# Altium schematic sheet RPL_MAP.SchDoc: Power Distribution Board Top View
size A; Date: Dec 27, 2017; DrawnBy: Seyed Omid Hasanli; Revision: 4.0; SheetNumber: 14
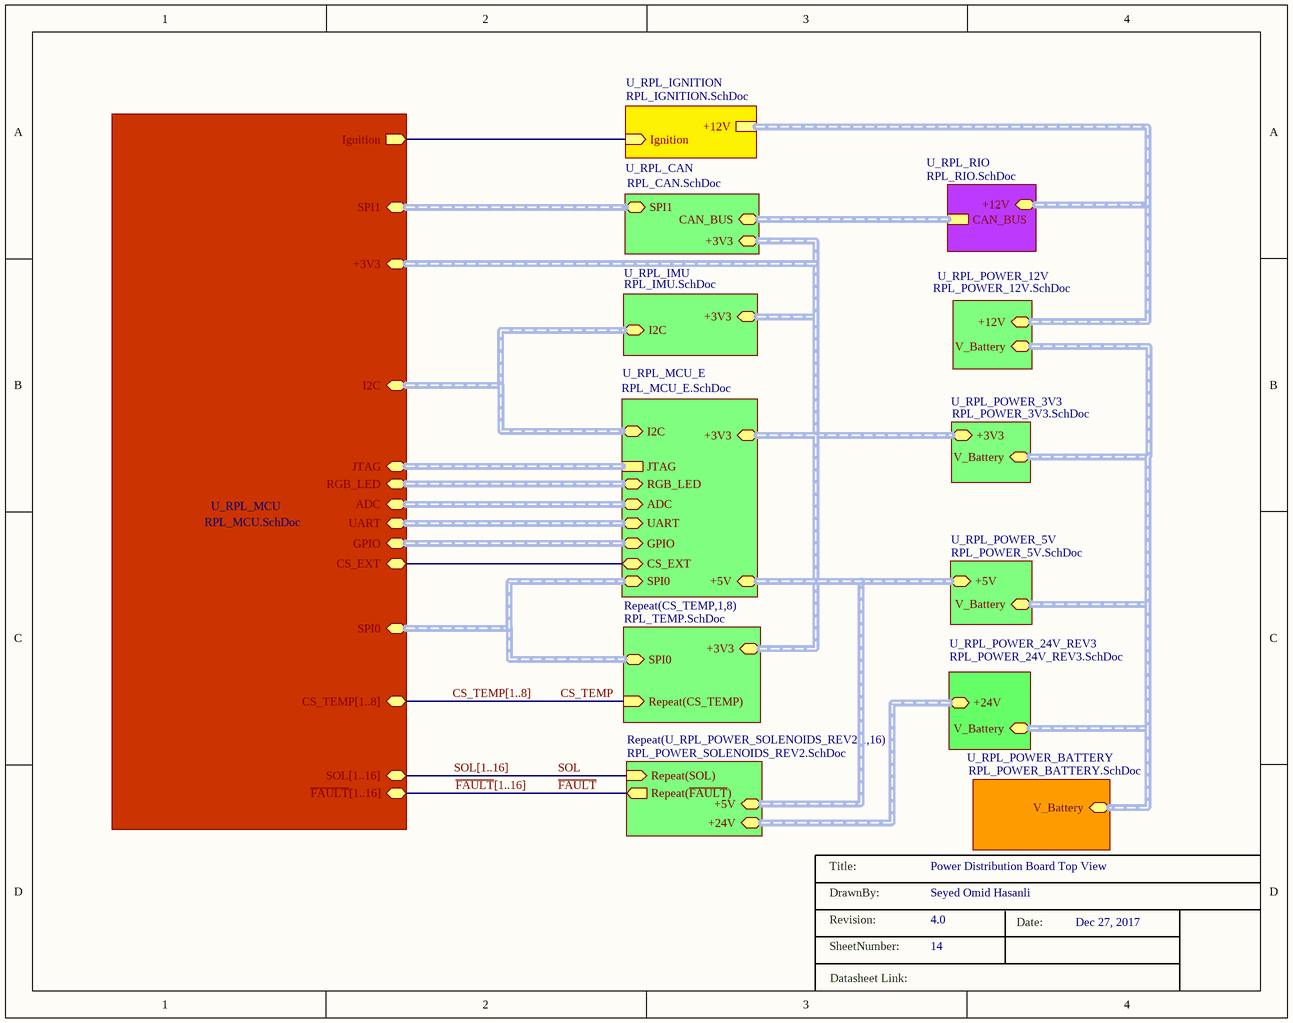
[diagram p0: RPL_MAP.SchDoc]

## Sub-sheets
Repeat(CS_TEMP,1,8) = RPL_TEMP.SchDoc: Repeat(CS_TEMP) (in), +3V3 (harness +3V3), SPI0 (harness SPI0)
Repeat(U_RPL_POWER_SOLENOIDS_REV2,1,16) = RPL_POWER_SOLENOIDS_REV2.SchDoc: Repeat(SOL) (in), Repeat(~{FAULT}) (out), +5V (harness +5V), +24V (harness +24V)
U_RPL_CAN = RPL_CAN.SchDoc: CAN_BUS (harness CAN), SPI1 (harness SPI1), +3V3 (harness +3V3)
U_RPL_IGNITION = RPL_IGNITION.SchDoc: +12V (harness +12V), Ignition (in)
U_RPL_IMU = RPL_IMU.SchDoc: I2C (harness I2C), +3V3 (harness +3V3)
U_RPL_MCU = RPL_MCU.SchDoc: ~{FAULT}[1..16], SOL[1..16], CS_TEMP[1..8], UART (harness UART), JTAG (harness JTAG), ADC (harness ADC), RGB_LED (harness RGB_LED), GPIO (harness GPIO), SPI0 (harness SPI0), SPI1 (harness SPI1), I2C (harness I2C), +3V3 (harness +3V3), CS_EXT (bidir), Ignition (out)
U_RPL_MCU_E = RPL_MCU_E.SchDoc: JTAG (harness JTAG), RGB_LED (harness RGB_LED), ADC (harness ADC), UART (harness UART), CS_EXT, GPIO (harness GPIO), I2C (harness I2C), SPI0 (harness SPI0), +3V3 (harness +3V3), +5V (harness +5V)
U_RPL_POWER_3V3 = RPL_POWER_3V3.SchDoc: +3V3 (harness +3V3), V_Battery (harness V_Battery)
U_RPL_POWER_5V = RPL_POWER_5V.SchDoc: +5V (harness +5V), V_Battery (harness V_Battery)
U_RPL_POWER_12V = RPL_POWER_12V.SchDoc: +12V (harness +12V), V_Battery (harness V_Battery)
U_RPL_POWER_24V_REV3 = RPL_POWER_24V_REV3.SchDoc: +24V (harness +24V), V_Battery (harness V_Battery)
U_RPL_POWER_BATTERY = RPL_POWER_BATTERY.SchDoc: V_Battery (harness V_Battery)
U_RPL_RIO = RPL_RIO.SchDoc: CAN_BUS (harness CAN), +12V (harness +12V)

## Nets
CS_TEMP: sheet Repeat(CS_TEMP,1,8)/Repeat(CS_TEMP)
~{FAULT}: sheet Repeat(U_RPL_POWER_SOLENOIDS_REV2,1,16)/Repeat(~{FAULT})
SOL: sheet Repeat(U_RPL_POWER_SOLENOIDS_REV2,1,16)/Repeat(SOL)
(unnamed): sheet U_RPL_MCU/CS_EXT, sheet U_RPL_MCU_E/CS_EXT
(unnamed): sheet U_RPL_MCU/Ignition, sheet U_RPL_IGNITION/Ignition

## Buses and harness runs
bus CS_TEMP[1..8] = sheet U_RPL_MCU/CS_TEMP[1..8]
bus SOL[1..16] = sheet U_RPL_MCU/SOL[1..16]
bus ~{FAULT}[1..16] = sheet U_RPL_MCU/~{FAULT}[1..16]
harness sheet Repeat(CS_TEMP,1,8)/+3V3 = sheet U_RPL_CAN/+3V3 = sheet U_RPL_IMU/+3V3 = sheet U_RPL_MCU/+3V3 = sheet U_RPL_MCU_E/+3V3 = sheet U_RPL_POWER_3V3/+3V3
harness sheet Repeat(CS_TEMP,1,8)/SPI0 = sheet U_RPL_MCU/SPI0 = sheet U_RPL_MCU_E/SPI0
harness sheet Repeat(U_RPL_POWER_SOLENOIDS_REV2,1,16)/+5V = sheet U_RPL_MCU_E/+5V = sheet U_RPL_POWER_5V/+5V
harness sheet Repeat(U_RPL_POWER_SOLENOIDS_REV2,1,16)/+24V = sheet U_RPL_POWER_24V_REV3/+24V
harness sheet U_RPL_CAN/CAN_BUS = sheet U_RPL_RIO/CAN_BUS
harness sheet U_RPL_CAN/SPI1 = sheet U_RPL_MCU/SPI1
harness sheet U_RPL_IGNITION/+12V = sheet U_RPL_POWER_12V/+12V = sheet U_RPL_RIO/+12V
harness sheet U_RPL_IMU/I2C = sheet U_RPL_MCU/I2C = sheet U_RPL_MCU_E/I2C
harness sheet U_RPL_MCU/ADC = sheet U_RPL_MCU_E/ADC
harness sheet U_RPL_MCU/GPIO = sheet U_RPL_MCU_E/GPIO
harness sheet U_RPL_MCU/JTAG = sheet U_RPL_MCU_E/JTAG
harness sheet U_RPL_MCU/RGB_LED = sheet U_RPL_MCU_E/RGB_LED
harness sheet U_RPL_MCU/UART = sheet U_RPL_MCU_E/UART
harness sheet U_RPL_POWER_3V3/V_Battery = sheet U_RPL_POWER_5V/V_Battery = sheet U_RPL_POWER_12V/V_Battery = sheet U_RPL_POWER_24V_REV3/V_Battery = sheet U_RPL_POWER_BATTERY/V_Battery

## Notes on the sheet
- Title:
- DrawnBy:
- Revision:
- SheetNumber:
- Date:
- Datasheet Link: